# EAGLE design 7073:8 (EAGLE 9.6.2)
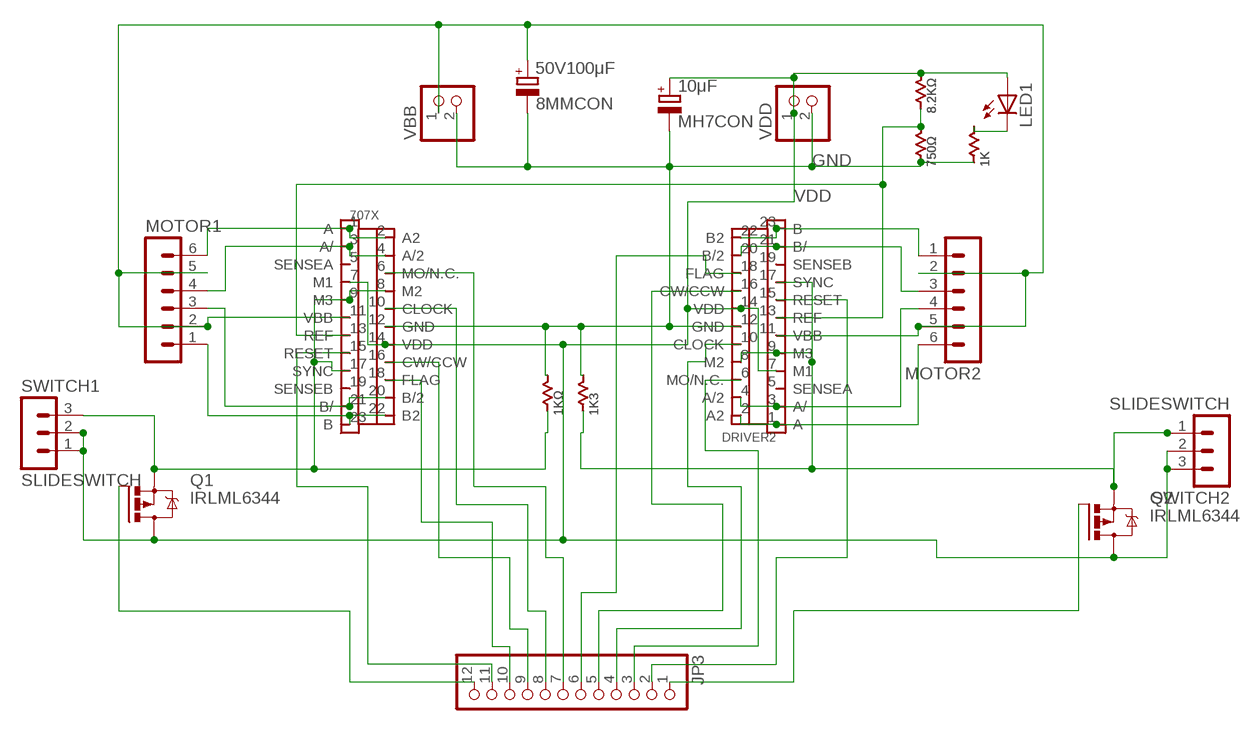
[diagram p0: schematic, sheet 1]

## Parts
1K  R1608  [C1608]
1K3  R1608  [C1608]
1KΩ  R1608  [C1608]
8.2KΩ  1/6W  [1/6WRESISTANCE]
10μF  MH7CON  [MH7CON]
50V100μF  8MMCON  [50V100FCON]
707X  SLA707X  [23-2PINHEAD]
750Ω  1/6W  [1/6WRESISTANCE]
DRIVER2  SLA707X  [23-2PINHEAD]
JP3  PINHD-1X12  [1X12]
LED1  OPTOCHIPLEDLED  [CHIP]
MOTOR1  MA06-1  [MA06-1]
MOTOR2  MA06-1  [MA06-1]
Q1  IRLML6344  IRLML5203  [MICRO3]
Q2  IRLML6344  IRLML5203  [MICRO3]
SWITCH1  SLIDESWITCH  [M251]
SWITCH2  SLIDESWITCH  [M251]
VBB  PINHD-1X2  [1X02]
VDD  PINHD-1X2  [1X02]

## Nets
GND: 1K3.1(B) 1K.2(A) 1KΩ.1(B) 10μF.P$2(-) 50V100μF.P$2(-) 707X.12(GND) 750Ω.P$2(A) DRIVER2.12(GND) VBB.2 VDD.2
N$1: 707X.22(B2) 707X.23(B) MOTOR1.1
N$2: 707X.20(B/2) 707X.21(B/) MOTOR1.3
N$3: 707X.1(A) 707X.2(A2) MOTOR1.6
N$4: 707X.3(A/) 707X.4(A/2) MOTOR1.4
N$5: DRIVER2.1(A) DRIVER2.2(A2) MOTOR2.6
N$6: DRIVER2.3(A/) DRIVER2.4(A/2) MOTOR2.4
N$7: DRIVER2.20(B/2) DRIVER2.21(B/) MOTOR2.3
N$8: DRIVER2.22(B2) DRIVER2.23(B) MOTOR2.1
N$9: 1K.1(B) LED1.P$2(C)
N$10: 707X.15(RESET) JP3.11
N$11: JP3.12 Q1.1(G)
N$12: 50V100μF.P$1(+) 707X.11(VBB) DRIVER2.11(VBB) MOTOR1.2 MOTOR1.5 MOTOR2.2 MOTOR2.5 VBB.1
N$13: 707X.18(FLAG) JP3.10
N$14: 8.2KΩ.P$2(A) 707X.13(REF) 750Ω.P$1(B) DRIVER2.13(REF)
N$15: 1K3.2(A) DRIVER2.8(M2) DRIVER2.9(M3) DRIVER2.17(SYNC) Q2.2(S) SWITCH2.1
N$16: 1KΩ.2(A) 707X.8(M2) 707X.9(M3) 707X.17(SYNC) Q1.2(S) SWITCH1.3
N$17: 707X.16(CW/CCW) JP3.9
N$18: 707X.10(CLOCK) JP3.8
N$19: 707X.6(MO/N.C.) JP3.7
N$20: JP3.1 Q2.1(G)
N$21: DRIVER2.15(RESET) JP3.2
N$22: DRIVER2.6(MO/N.C.) JP3.3
N$23: DRIVER2.10(CLOCK) JP3.4
N$24: DRIVER2.16(CW/CCW) JP3.5
N$25: DRIVER2.18(FLAG) JP3.6
VDD: 8.2KΩ.P$1(B) 10μF.P$1(+) 707X.7(M1) 707X.14(VDD) DRIVER2.7(M1) DRIVER2.14(VDD) LED1.P$1(A) Q1.3(D) Q2.3(D) SWITCH1.1 SWITCH1.2 SWITCH2.2 SWITCH2.3 VDD.1
Unconnected: 707X.5(SENSEA) 707X.19(SENSEB) DRIVER2.5(SENSEA) DRIVER2.19(SENSEB)

## Library data of the parts
1K 1K3 1KΩ = A mylibrary:R1608
8.2KΩ 750Ω = A mylibrary:1/6W
10μF = A mylibrary:MH7CON
50V100μF = A mylibrary:8MMCON
707X DRIVER2 = A mylibrary:SLA707X
JP3 = pinhead:PINHD-1X12: PIN HEADER
LED1 = A mylibrary:OPTOCHIPLED
MOTOR1 MOTOR2 = con-lstb:MA06-1: PIN HEADER; OC_FARNELL: unknown; OC_NEWARK: unknown
Q1 Q2 = transistor-power:IRLML5203: HEXFET P-Channel Power MOSFET
SWITCH1 SWITCH2 = A mylibrary:SLIDESWITCH
VBB VDD = pinhead:PINHD-1X2: PIN HEADER

## Board
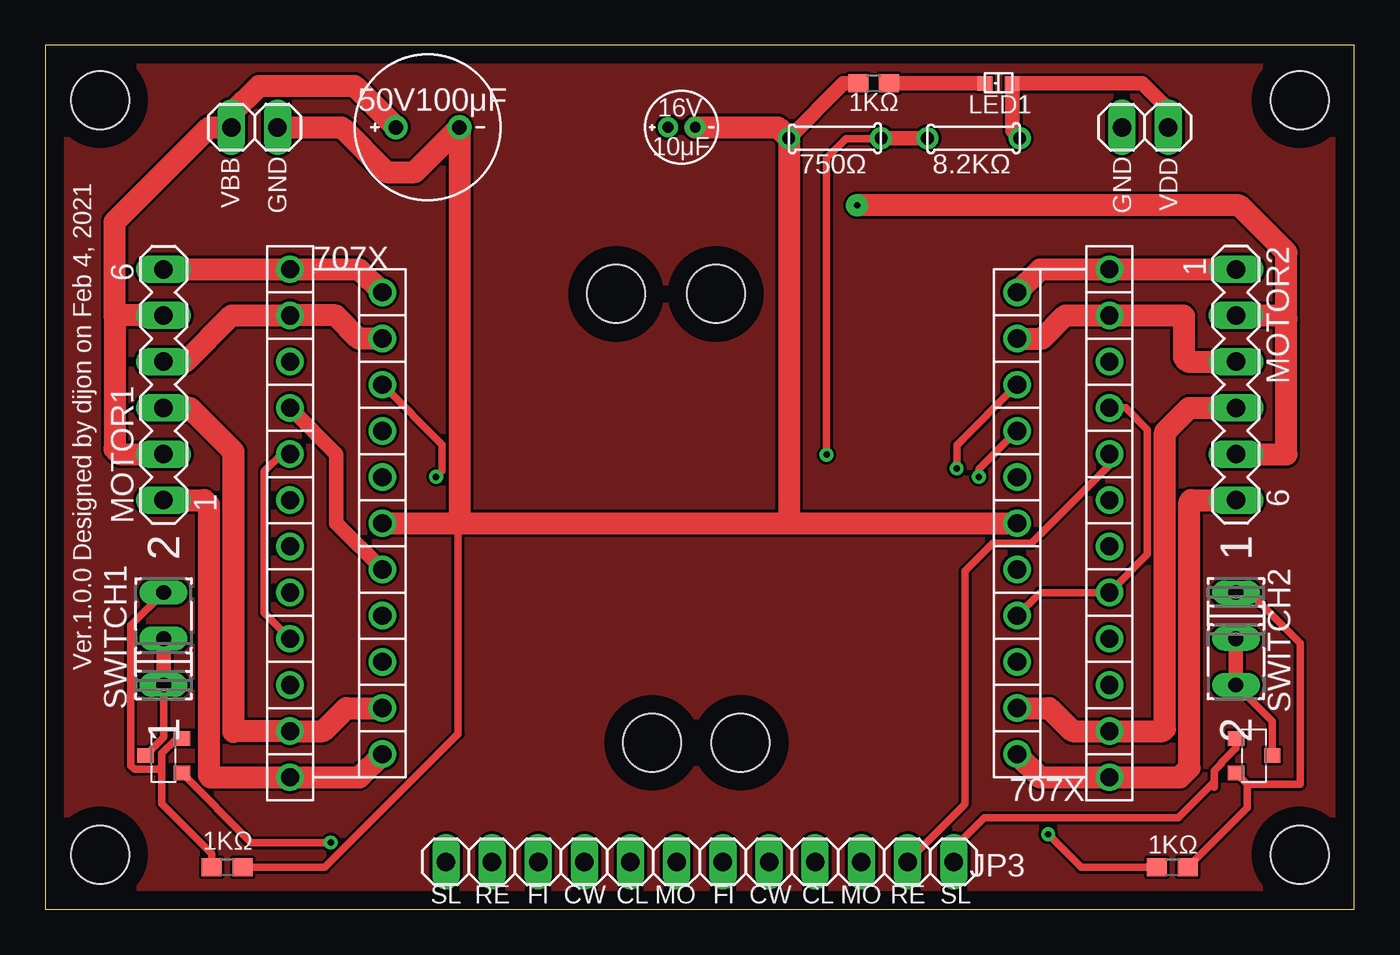
[diagram p1: board, top side]
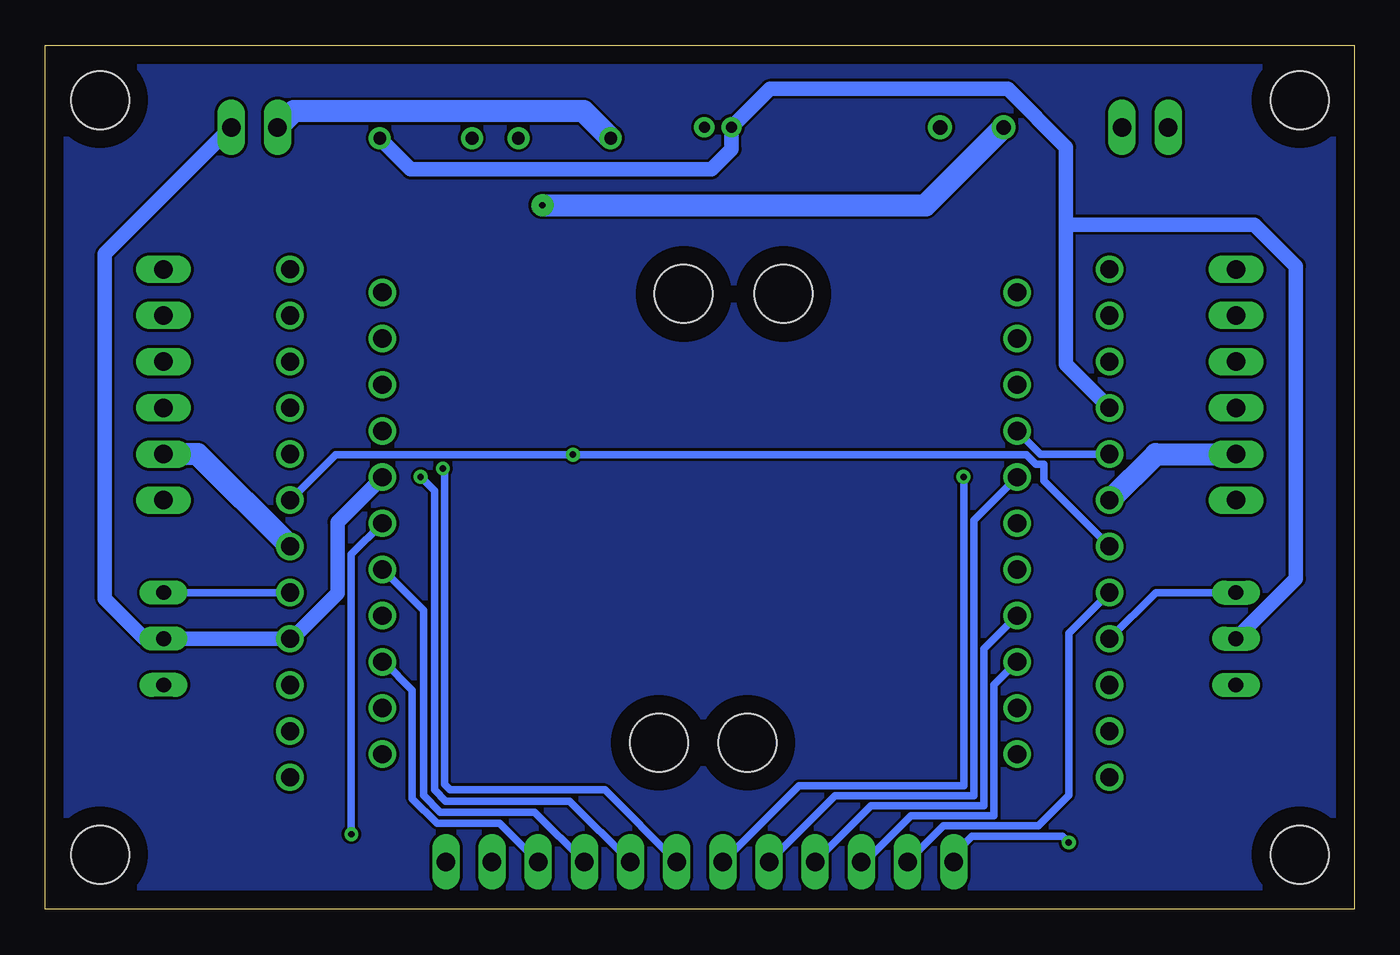
[diagram p2: board, bottom side, seen from below]

Size 72 x 47.5 mm. Coordinates in mm from the lower left corner, seen from the top.
Outline: 0,0 72,0 72,47.5 0,47.5 0,0
Copper layers (1*16): Top 0.035mm / dielectric 1.5mm / Bottom 0.035mm
Design rules "default": minimum track width 6mil, minimum drill 0.35mm, track to track 6mil, track to pad 6mil, pad to pad 6mil, via to via 6mil, smd to smd 6mil, copper to edge 40mil, drill to drill 6mil, minimum pad ring 10mil, minimum via ring 8mil, stop-mask expansion 4mil, vias tented up to drill 0mil, thermal gap 10mil
Holes 3.2 mm at 3,3 3,44.5 69,44.5 69,3 31.39,33.83 33.38,9.14 36.88,33.83 38.25,9.14

### Footprints (pad centres in the part's own frame; a part is rotated, then mirrored left to right if it is on the bottom)
C1608 = smd 1.1 x 1: 1 -0.85,0; 2 0.85,0
1/6WRESISTANCE = drill 0.7: P$1 0,2.54; P$2 0,-2.54
MH7CON = drill 0.6: P$1 -0.75,0; P$2 0.75,0
50V100FCON = drill 0.8: P$1 -1.75,0; P$2 1.75,0
23-2PINHEAD = drill 1: 1 -2.54,13.97; 2 2.54,12.7; 3 -2.54,11.43; 4 2.54,10.16; 5 -2.54,8.89; 6 2.54,7.62; 7 -2.54,6.35; 8 2.54,5.08; 9 -2.54,3.81; 10 2.54,2.54; 11 -2.54,1.27; 12 2.54,0; 13 -2.54,-1.27; 14 2.54,-2.54; 15 -2.54,-3.81; 16 2.54,-5.08; 17 -2.54,-6.35; 18 2.54,-7.62; 19 -2.54,-8.89; 20 2.54,-10.16; 21 -2.54,-11.43; 22 2.54,-12.7; 23 -2.54,-13.97
1X12 = drill 1.016 long: 1 -13.97,0; 2 -11.43,0; 3 -8.89,0; 4 -6.35,0; 5 -3.81,0; 6 -1.27,0; 7 1.27,0; 8 3.81,0; 9 6.35,0; 10 8.89,0; 11 11.43,0; 12 13.97,0
CHIP = smd 0.8 x 0.8: P$1 -0.75,0; P$2 0.75,0
MA06-1 = drill 1.016 long: 1 -6.35,0; 2 -3.81,0; 3 -1.27,0; 4 1.27,0; 5 3.81,0; 6 6.35,0
MICRO3 = smd 0.8 x 0.9: 1 -0.95,-1; 2 0.95,-1; 3 0,1
M251 = drill 0.813 long: 1 -2.54,0; 2 0,0; 3 2.54,0
1X02 = drill 1.016 long: 1 -1.27,0; 2 1.27,0

### Placement (x,y rotation side)
1K  45.57,45.41 180 top
1K3  62,2.3 0 top
1KΩ  10,2.3 180 top
8.2KΩ  51.07,42.4 270 top
10μF  35,43 0 top
50V100μF  21.03,43 0 top
707X  16,21.22 0 top
750Ω  43.44,42.4 270 top
DRIVER2  56,21.22 180 top
JP3  36,2.6 180 top
LED1  52.44,45.41 180 top
MOTOR1  6.5,28.84 90 top
MOTOR2  65.5,28.84 270 top
Q1  6.5,8.44 90 top
Q2  66.5,8.44 270 top
SWITCH1  6.5,14.87 90 top
SWITCH2  65.5,14.87 270 top
VBB  11.5,43 0 top
VDD  60.5,43 180 top

### Tracks (layer width: path | path; a pad name or v marks a point on that pad's centre or on a via)
A
  pour Top: 0.46,47.24 0.46,0.46 71.63,0.46 71.63,47.09 0.61,47.09
B
  pour Bottom: 0.15,47.4 0.15,0.15 71.93,0.15 71.93,47.4
GND  (via drill 0.35 pad 0.1)
  Top 0.4: 22.71,21.22 22.71,9.63 15.37,2.3 1KΩ.1 | v55.17,4.12 56.98,2.3 1K3.1
  Top 0.8: 750Ω.P$2 43.91,45.41 1K.2
  Top 1.2: VBB.2 16.28,43 18.75,40.54 20.32,40.54 50V100μF.P$2 22.78,21.29 22.71,21.22 | 707X.12 22.71,21.22 | 22.71,21.22 40.84,21.22 | 40.84,21.22 DRIVER2.12 | 10μF.P$2 40.3,43 750Ω.P$2 40.9,21.27 40.84,21.22
  Bottom 0.4: DRIVER2.12 55.17,19.51 v55.17,4.12
  Bottom 1.2: 750Ω.P$2 42.39,43.89 58.34,43.89 VDD.2
N$1
  Top 1.2: MOTOR1.1 8.75,22.49 8.99,22.25 8.99,8.08 8.99,7.34 9.09,7.25 9.82,7.25 707X.23 17.27,7.25 707X.22
N$2
  Top 1.2: MOTOR1.3 7.94,27.57 10.34,25.16 10.34,9.75 10.38,9.79 707X.21 15.28,9.79 16.55,11.06 707X.20
N$3
  Top 1.2: MOTOR1.6 707X.1 17.27,35.19 707X.2
N$4
  Top 1.2: 707X.4 17.24,31.38 15.97,32.65 707X.3 10.25,32.65 7.71,30.11 MOTOR1.4
N$5
  Top 1.2: DRIVER2.2 54.73,7.25 DRIVER2.1 62.42,7.25 62.94,7.77 62.94,22.4 63.03,22.49 MOTOR2.6
N$6
  Top 1.2: DRIVER2.4 55.23,11.06 56.51,9.79 DRIVER2.3 61.47,9.79 61.59,9.91 61.59,26.23 62.93,27.57 MOTOR2.4
N$7
  Top 1.2: DRIVER2.20 54.85,31.38 56.12,32.65 DRIVER2.21 62.6,32.65 62.64,32.61 62.64,30.33 62.85,30.11 MOTOR2.3
N$8
  Top 1.2: DRIVER2.22 54.73,35.19 DRIVER2.23 MOTOR2.1
N$9
  Top 0.8: LED1.P$2 1K.1
N$10
  Bottom 0.4: 707X.15 15.7,15.17 15.7,6.25 17.37,4.57 22.6,4.57 JP3.11
N$11  (via drill 0.35 pad 0.1)
  Top 0.4: Q1.1 11.33,3.66 v15.7,3.66
  Bottom 0.4: v15.7,3.66 16.06,4.02 21.03,4.02 22.03,3.02 JP3.12
N$12  (via drill 0.35 pad 1.2)
  Top 1.2: MOTOR2.2 68.09,32.65 68.28,32.46 | 68.28,32.46 68.28,24.99 65.54,24.99 MOTOR2.5 | MOTOR1.5 3.85,32.65 | MOTOR1.2 4.08,25.03 3.81,25.3 3.81,32.61 3.85,32.65 | 3.81,37.8 3.85,37.76 | 3.81,37.8 9.02,43 VBB.1 10.23,43.76 11.75,45.28 17,45.28 50V100μF.P$1 | 68.28,32.46 68.28,36.12 65.68,38.71 v44.65,38.71 | 3.85,32.65 3.81,32.69 3.81,37.8
  Bottom 1.2: 707X.11 10.92,25.03 MOTOR1.2 | DRIVER2.11 63.62,25.03 MOTOR2.5 | v44.65,38.71 23.57,38.71 50V100μF.P$1
N$13
  Bottom 0.4: 707X.18 19.81,12.33 19.81,5.12 24.38,5.12 26.91,2.6 JP3.10
N$14  (via drill 0.35 pad 0.1)
  Top 0.4: 750Ω.P$1 45.95,42.37 44.04,42.37 42.98,41.3 v42.98,24.99
  Top 0.8: 750Ω.P$1 8.2KΩ.P$2
  Bottom 0.4: DRIVER2.13 56.04,24.99 v42.98,24.99 21.95,24.99 21.79,24.99 18.02,24.99 17.5,24.48 17.07,24.48 17.07,23.56 707X.13
N$15
  Top 0.4: DRIVER2.8 54.73,17.41 DRIVER2.9 60.64,19.51 60.64,26.36 59.43,27.57 DRIVER2.17 | Q2.2 66.13,6.86 | 66.13,6.86 69.04,6.86 69.04,14.63 66.26,17.41 SWITCH2.1 | 1K3.2 66.13,5.58 66.13,6.86
  Bottom 0.4: DRIVER2.9 SWITCH2.1
N$16
  Top 0.4: 707X.9 12.99,25.03 12.04,24.08 12.04,16.29 707X.17 | 1KΩ.2 9.15,3.05 6.4,5.8 6.4,7.62 | 6.4,7.62 6.33,7.69 4.9,7.69 4.7,7.89 4.7,15.61 SWITCH1.3 | Q1.2 7.41,9.3 7.14,9.3 6.4,8.56 6.4,7.62
  Bottom 0.4: SWITCH1.3 10.92,17.41 707X.17 | 707X.9 17.27,25.03 707X.8
N$17
  Bottom 0.4: 707X.16 20.36,14.31 20.36,5.68 26.57,5.68 JP3.9
N$18
  Bottom 0.4: JP3.8 28.56,6.23 20.92,6.23 20.92,20.88 20.92,21.38 707X.10
N$19  (via drill 0.35 pad 0.1)
  Top 0.4: v21.49,23.77 21.83,24.11 21.83,25.55 707X.6
  Bottom 0.4: JP3.7 30.55,6.78 21.47,6.78 21.47,23.75 v21.49,23.77
N$20
  Top 0.4: Q2.1 65.5,8.84 64.7,8.04 64.7,8.01 64.31,7.62 64.31,7.01 | 64.31,7.01 64.31,6.71 | 64.31,7.01 62.33,5.03 51.66,5.03 49.97,3.34 JP3.1
N$21
  Top 0.4: DRIVER2.15 58.54,24.4 54.25,20.11 53,20.11 53,20.12 52.12,20.12 50.6,18.59 50.6,5.77 JP3.2
N$22
  Bottom 0.4: JP3.3 47.01,4.72 50.46,4.72 51.82,6.08 51.82,12.04 53.38,13.6 DRIVER2.6
N$23
  Bottom 0.4: JP3.4 45.08,5.33 50.29,5.33 51.21,6.25 51.21,16.43 DRIVER2.10
N$24  (via drill 0.35 pad 0.1)
  Top 0.4: DRIVER2.16 51.36,24.2 v51.36,23.77
  Bottom 0.4: JP3.5 43.15,5.94 49.99,5.94 50.6,6.55 50.6,20.27 50.6,23.01 v51.36,23.77
N$25  (via drill 0.35 pad 0.1)
  Top 0.4: v50.14,24.23 50.14,25.52 DRIVER2.18
  Bottom 0.4: JP3.6 41.22,6.55 49.74,6.55 50.04,6.86 50.04,24.14 v50.14,24.23
VDD
  Top 0.4: SWITCH2.3 67.5,10.33 Q2.3 | SWITCH1.1 6.5,9.44 Q1.3
  Top 0.8: 8.2KΩ.P$1 53.19,42.82 LED1.P$1 60.35,45.41 61.77,44 VDD.1 | SWITCH1.2 SWITCH1.1 | SWITCH2.2 SWITCH2.3 | 707X.7 16,25.03 16,21.22 707X.14
  Bottom 0.8: DRIVER2.14 55.93,21.29 55.93,17.37 58.44,14.87 DRIVER2.7 SWITCH2.2 66.53,14.87 68.73,17.07 68.73,36.04 VDD.1 | 8.2KΩ.P$1 51.9,40.69 35.36,40.69 34.25,41.8 10μF.P$1 32.14,45.11 19.05,45.11 15.85,41.91 15.85,37.64 | 707X.7 15.85,29.96 15.85,37.64 | SWITCH1.2 3.2,18.17 3.2,35.36 5.49,37.64 15.85,37.64

### Text on the board
tNames: 16V | 1KΩ | 10μF | Ver.1.0.0 Designed by dijon on Feb 4, 2021 | VBB | GND | GND | 707X | 1KΩ | SL | RE | Fl | CW | CL | MO | Fl | CW | CL | MO | RE | SL